# Altium project Remoter_8KEY.PrjPCB
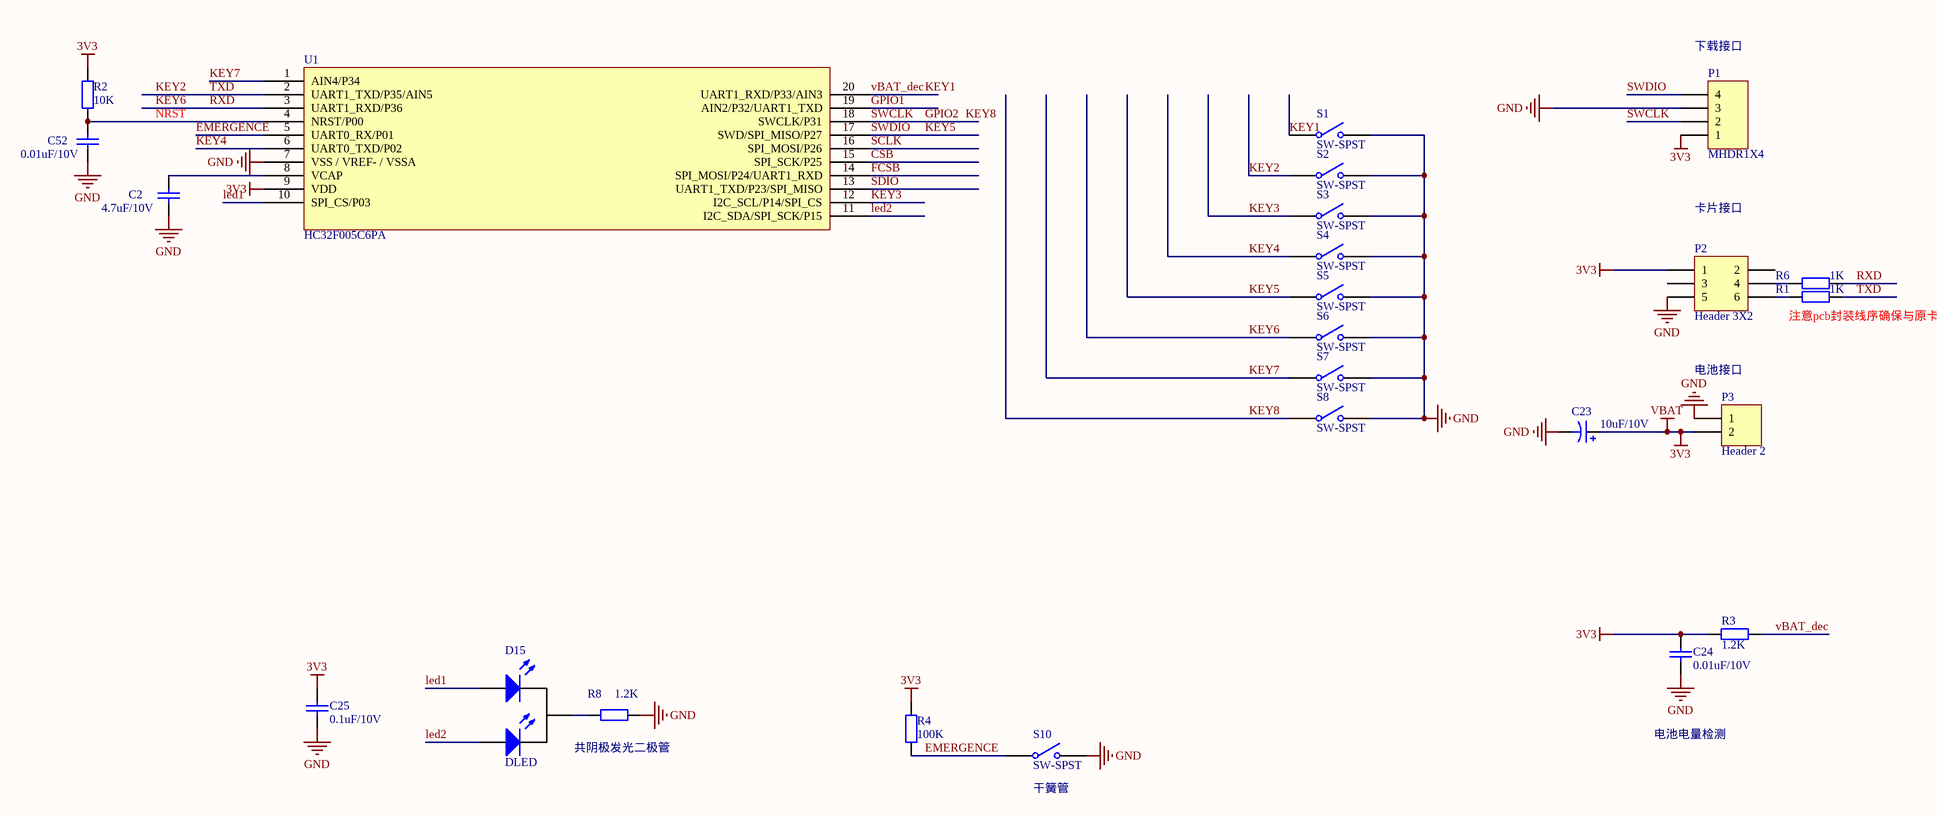
[diagram p0: mcu.SchDoc]
2 sheets, 52 parts. Net scope: global (net labels, ports and power ports of the same name join across sheets).
Board file: F21-SEND-CTM.PcbDoc
Sheets:
  mcu.SchDoc
  RF.SchDoc

## Sheet mcu.SchDoc
size A3

### Parts
C2  4.7uF/10V  [0603C]
C23  10uF/10V
C24  0.01uF/10V  [0603C]
C25  0.1uF/10V  [0603C]
C52  0.01uF/10V  [0603C]
D15  DLED
P1  MHDR1X4  [SIP4]
P2  Header 3X2
P3  Header 2
R1  1K  [0603R]
R2  10K  [0603R]
R3  1.2K  [0603R]
R4  100K  [0603R]
R6  1K  [0603R]
R8  1.2K  [0603R]
S1  SW-SPST
S2  SW-SPST
S3  SW-SPST
S4  SW-SPST
S5  SW-SPST
S6  SW-SPST
S7  SW-SPST
S8  SW-SPST
S10  SW-SPST
U1  HC32F005C6PA

### Nets
3V3: C23.1 C24.1 C25.1 P1.1 P2.1 P3.2 R2.2 R3.2 R4.1 U1.9(VDD)  [also labelled VBAT]
GND: C2.2 C23.2 C24.2 C25.2 C52.2 P1.3 P2.5 P3.1 R8.1 S1.2(NO) S2.2(NO) S3.2(NO) S4.2(NO) S5.2(NO) S6.2(NO) S7.2(NO) S8.2(NO) S10.2(NO) U1.7(VSS_/_VREF-_/_VSSA)
CSB: U1.15(SPI_SCK/P25)
EMERGENCE: R4.2 S10.1(COMMON) U1.5(UART0_RX/P01)
FCSB: U1.14(SPI_MOSI/P24/UART1_RXD)
GPIO1: U1.19(AIN2/P32/UART1_TXD)
GPIO2: P1.2 S8.1(COMMON) U1.18(SWCLK/P31)  [also labelled KEY8, SWCLK]
KEY1: R3.1 S1.1(COMMON) U1.20(UART1_RXD/P33/AIN3)  [also labelled vBAT_dec]
KEY2: R1.1 S2.1(COMMON) U1.2(UART1_TXD/P35/AIN5)  [also labelled TXD]
KEY3: S3.1(COMMON) U1.12(I2C_SCL/P14/SPI_CS)
KEY4: S4.1(COMMON) U1.6(UART0_TXD/P02)
KEY5: P1.4 S5.1(COMMON) U1.17(SWD/SPI_MISO/P27)  [also labelled SWDIO]
KEY6: R6.1 S6.1(COMMON) U1.3(UART1_RXD/P36)  [also labelled RXD]
KEY7: S7.1(COMMON) U1.1(AIN4/P34)
led1: D15.1(A) U1.10(SPI_CS/P03)
led2: D15.3(A) U1.11(I2C_SDA/SPI_SCK/P15)
NRST: C52.1 R2.1 U1.4(NRST/P00)
SCLK: U1.16(SPI_MOSI/P26)
SDIO: U1.13(UART1_TXD/P23/SPI_MISO)
NetC2_1: C2.1 U1.8(VCAP)
NetD15_2: D15.2(K) R8.2
NetP2_4: P2.4 R6.2
NetP2_6: P2.6 R1.2

Not connected (* = marked no-connect by the designer): P2 2 3

### Notes on the sheet
- (near P1) 下载接口
- 卡片接口
- (near R1) 注意pcb封装线序确保与原卡片接口一致
- (near P3) 电池接口
- 共阴极发光二极管
- 电池电量检测
- (near S10) 干簧管

### Library data of the parts
C2 C24 C25 C52 = Cap: Capacitor; Value: 106; Published: 8-Jun-2000; LatestRevisionDate: 17-Jul-2002; LatestRevisionNote: Re-released for DXP Platform.; PackageReference: RAD-0.3; Publisher: Altium Limited
C23 = Cap Pol1: Polarized Capacitor (Radial); Value: 100pF; Published: 8-Jun-2000; LatestRevisionDate: 17-Jul-2002; LatestRevisionNote: Re-released for DXP Platform.; PackageReference: RB7.6-15; Publisher: Altium Limited
P1 = MHDR1X4: Header, 4-Pin; LatestRevisionDate: 17-Jul-2002; LatestRevisionNote: Re-released for DXP Platform.; Publisher: Altium Limited
P2 = Header 3X2: Header, 3-Pin, Dual row; LatestRevisionDate: 17-Jul-2002; LatestRevisionNote: Re-released for DXP Platform.; Publisher: Altium Limited
P3 = Header 2: Header, 2-Pin; LatestRevisionDate: 17-Jul-2002; LatestRevisionNote: Re-released for DXP Platform.; Publisher: Altium Limited
R1-R4 R6 R8 = Res2: Resistor; Value: 10K/5%/1/8W; Published: 8-Jun-2000; LatestRevisionDate: 17-Jul-2002; LatestRevisionNote: Re-released for DXP Platform.; PackageReference: AXIAL-0.4; Publisher: Altium Limited
S1-S8 S10 = SW-SPST: Single-Pole, Single-Throw Switch; Published: 24-Mar-1999; LatestRevisionDate: 17-Jul-2002; LatestRevisionNote: Re-released for DXP Platform.; PackageReference: SPST-2; Publisher: Altium Limited

## Sheet RF.SchDoc
size A3
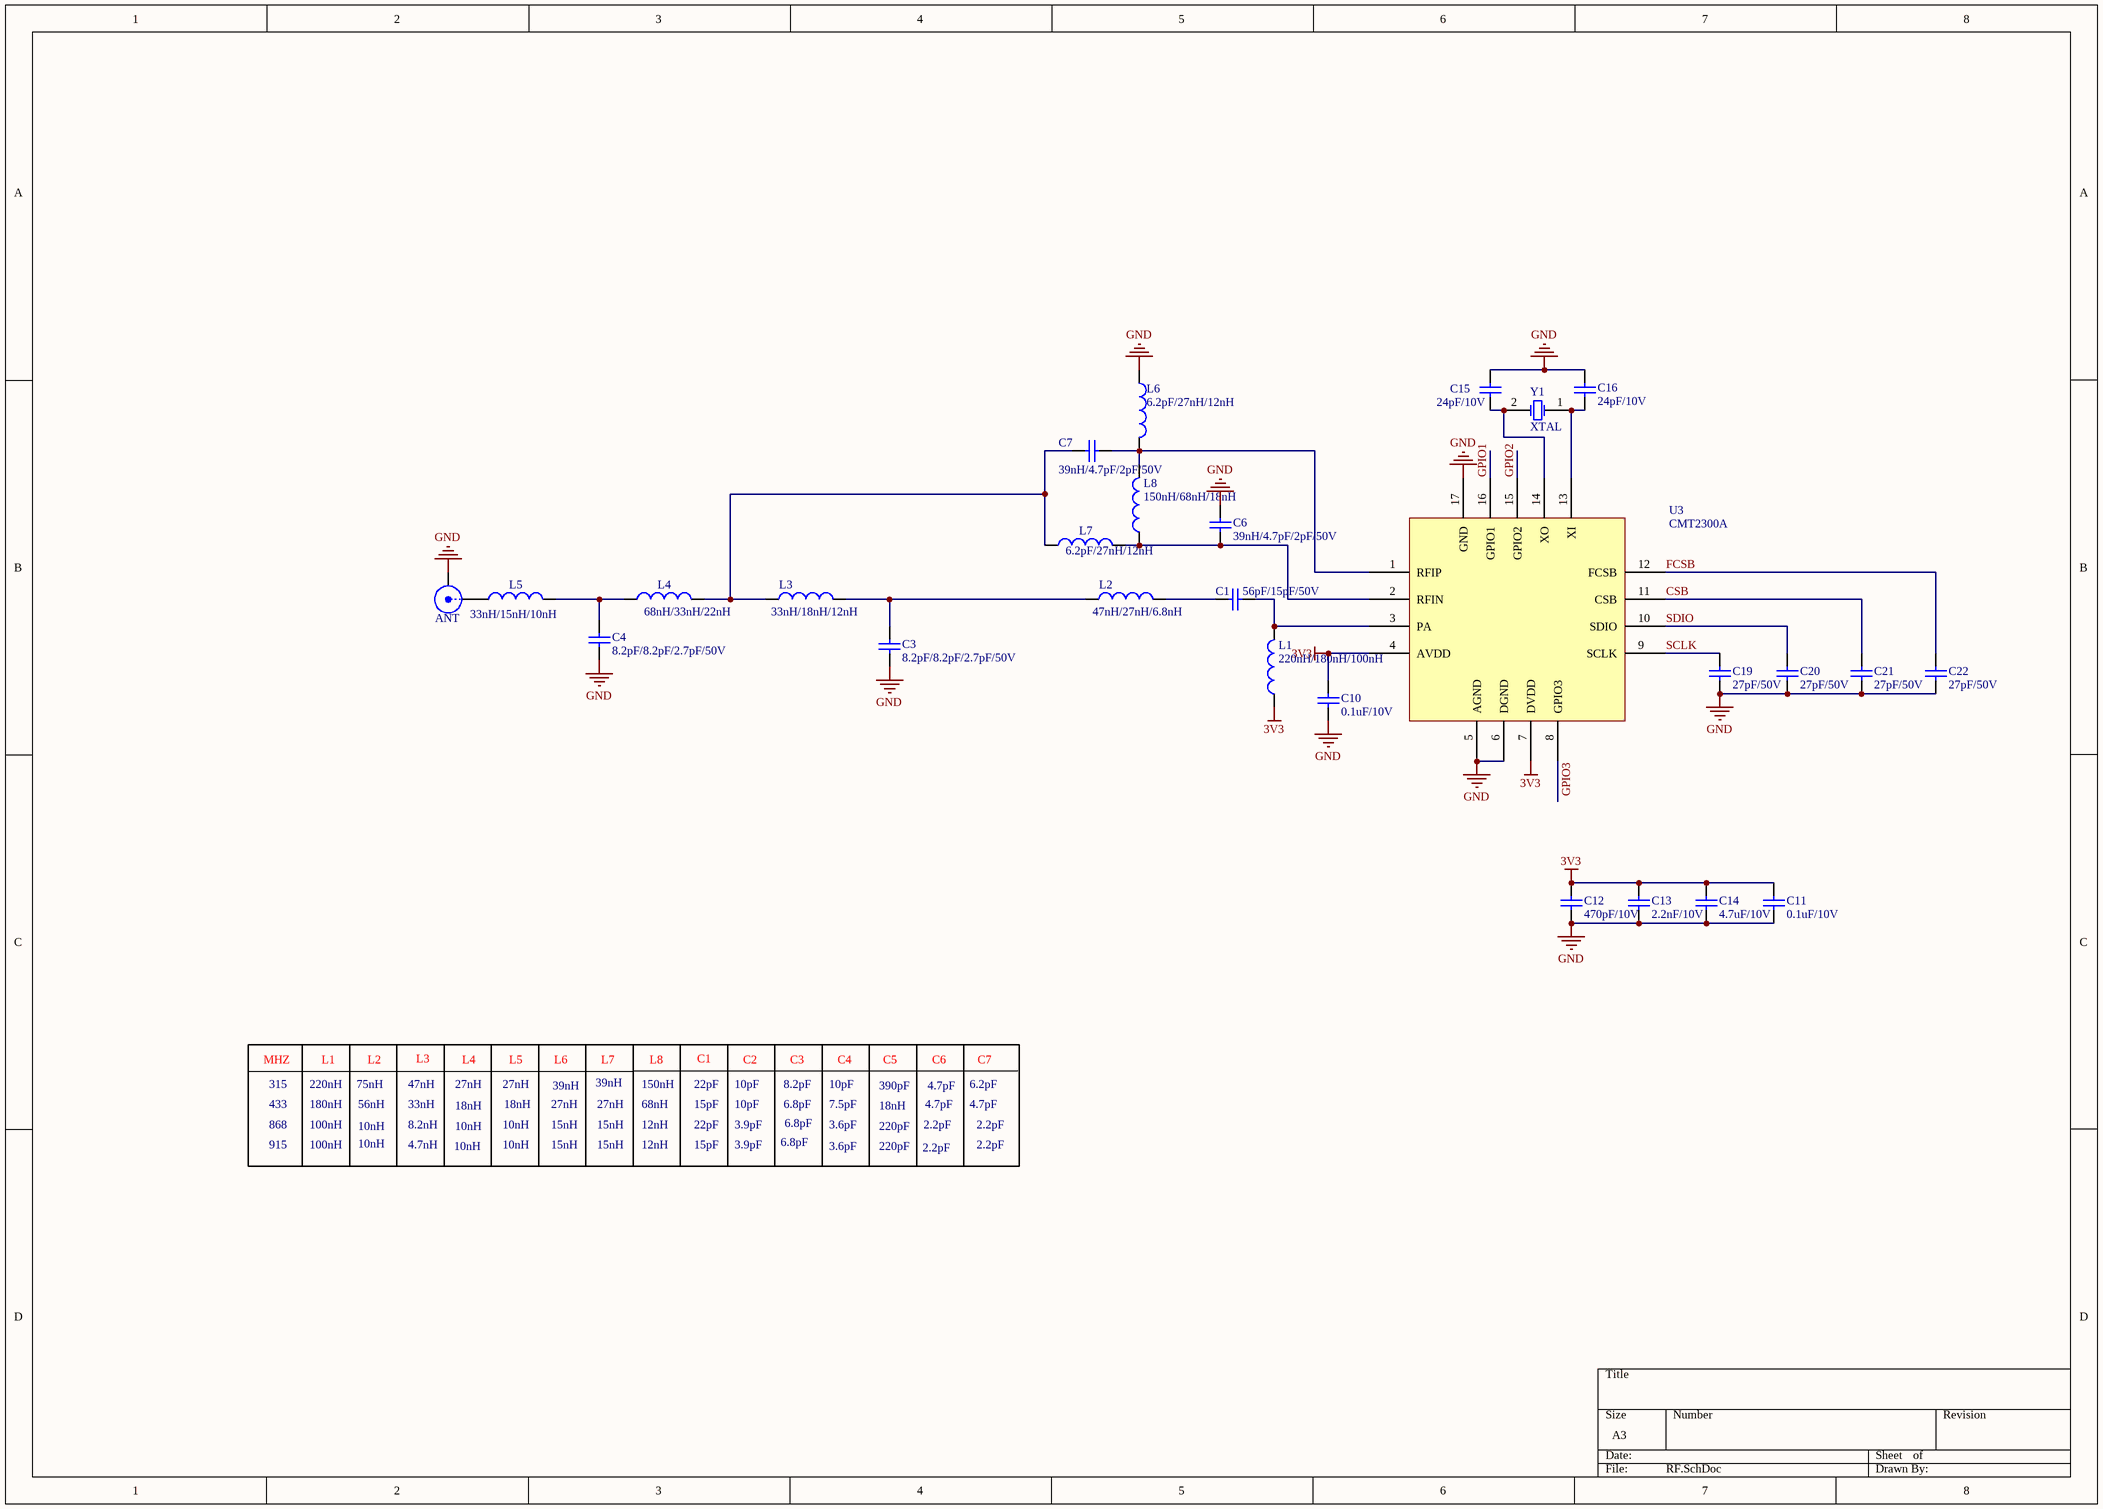
[diagram p1: RF.SchDoc]

### Parts
ANT  (no value)  [SMA Straight SMD]
C1  56pF/15pF/50V  [0603C]
C3  8.2pF/8.2pF/2.7pF/50V  [0603C]
C4  8.2pF/8.2pF/2.7pF/50V  [0603C]
C6  39nH/4.7pF/2pF/50V  [0603C]
C7  39nH/4.7pF/2pF/50V  [0603C]
C10  0.1uF/10V  [0603C]
C11  0.1uF/10V  [0603C]
C12  470pF/10V  [0603C]
C13  2.2nF/10V  [0603C]
C14  4.7uF/10V  [0603C]
C15  24pF/10V  [0603C]
C16  24pF/10V  [0603C]
C19  27pF/50V  [0603C]
C20  27pF/50V  [0603C]
C21  27pF/50V  [0603C]
C22  27pF/50V  [0603C]
L1  220nH/180nH/100nH  [0603R]
L2  47nH/27nH/6.8nH  [0603R]
L3  33nH/18nH/12nH  [0603R]
L4  68nH/33nH/22nH  [0603R]
L5  33nH/15nH/10nH  [0603R]
L6  6.2pF/27nH/12nH  [0603R]
L7  6.2pF/27nH/12nH  [0603R]
L8  150nH/68nH/18nH  [0603R]
U3  CMT2300A
Y1  XTAL  [BCY-W2/D3.1]

### Nets
3V3: C10.1 C11.1 C12.1 C13.1 C14.1 L1.1 U3.4(AVDD) U3.7(DVDD)
GND: ANT.2(GND) C3.2 C4.2 C6.2 C10.2 C11.2 C12.2 C13.2 C14.2 C15.1 C16.1 C19.2 C20.2 C21.2 C22.2 L6.1 U3.5(AGND) U3.6(DGND) U3.17(GND)
CSB: C21.1 U3.11(CSB)
FCSB: C22.1 U3.12(FCSB)
GPIO1: U3.16(GPIO1)
GPIO2: U3.15(GPIO2)
GPIO3: U3.8(GPIO3)
SCLK: C19.1 U3.9(SCLK)
SDIO: C20.1 U3.10(SDIO)
NetANT_1: ANT.1(Signal) L5.1
NetC1_1: C1.1 L2.2
NetC1_2: C1.2 L1.2 U3.3(PA)
NetC3_1: C3.1 L2.1 L3.2
NetC4_1: C4.1 L4.1 L5.2
NetC6_1: C6.1 L7.2 L8.1 U3.2(RFIN)
NetC7_1: C7.1 L3.1 L4.2 L7.1
NetC7_2: C7.2 L6.2 L8.2 U3.1(RFIP)
NetC15_2: C15.2 U3.14(XO) Y1.2(OSC2)
NetC16_2: C16.2 U3.13(XI) Y1.1(OSC1)

### Notes on the sheet
- MHZ
- 315
- 433
- 868
- 220nH
- 180nH
- 100nH
- L1
- 75nH
- 56nH
- L2
- 47nH
- 33nH
- 8.2nH
- L3
- 27nH
- 18nH
- L4
- 10nH
- L5
- 15nH
- 39nH
- L6
- L7
- 150nH
- 68nH
- 12nH
- L8
- 22pF
- 15pF
- C1
- 10pF
- 3.9pF
- C2
- 8.2pF
- 6.8pF
- C3
- 7.5pF
- 3.6pF
- C4
- 390pF
- C5
- 2.2pF
- 4.7pF
- C6
- 6.2pF
- C7
- 915
- 4.7nH
- 220pF

### Library data of the parts
ANT = SMA: SMA Straight Connector; LatestRevisionDate: 05-oct-2007  -  Semtech; LatestRevisionNote: Re-released for DXP Platform.; Publisher: Altium Limited
C1 C3 C4 C6 C7 C10-C16 C19-C22 = Cap: Capacitor; Value: 106; Published: 8-Jun-2000; LatestRevisionDate: 17-Jul-2002; LatestRevisionNote: Re-released for DXP Platform.; PackageReference: RAD-0.3; Publisher: Altium Limited
L1-L8 = Inductor: Code_IEC: 1005; Value: 10mH; Published: 8-Jun-2000; LatestRevisionDate: 29-May-2009; LatestRevisionNote: IPC-7351 Footprint Added.; PackageReference: 0402-A; Publisher: Altium Limited; PackageDescription: Chip Inductor; Code_JEITA: 0402
Y1 = XTAL: Crystal Oscillator; Published: 8-Jun-2000; LatestRevisionDate: 17-Jul-2002; LatestRevisionNote: Re-released for DXP Platform.; PackageReference: R38; Publisher: Altium Limited

## Nets that join several sheets
3V3: mcu (10 pins), RF (8 pins)
GND: mcu (19 pins), RF (19 pins)
CSB: mcu (U1.15), RF (C21.1 U3.11)
FCSB: mcu (U1.14), RF (C22.1 U3.12)
GPIO1: mcu (U1.19), RF (U3.16)
GPIO2: mcu (P1.2 S8.1 U1.18), RF (U3.15)
SCLK: mcu (U1.16), RF (C19.1 U3.9)
SDIO: mcu (U1.13), RF (C20.1 U3.10)